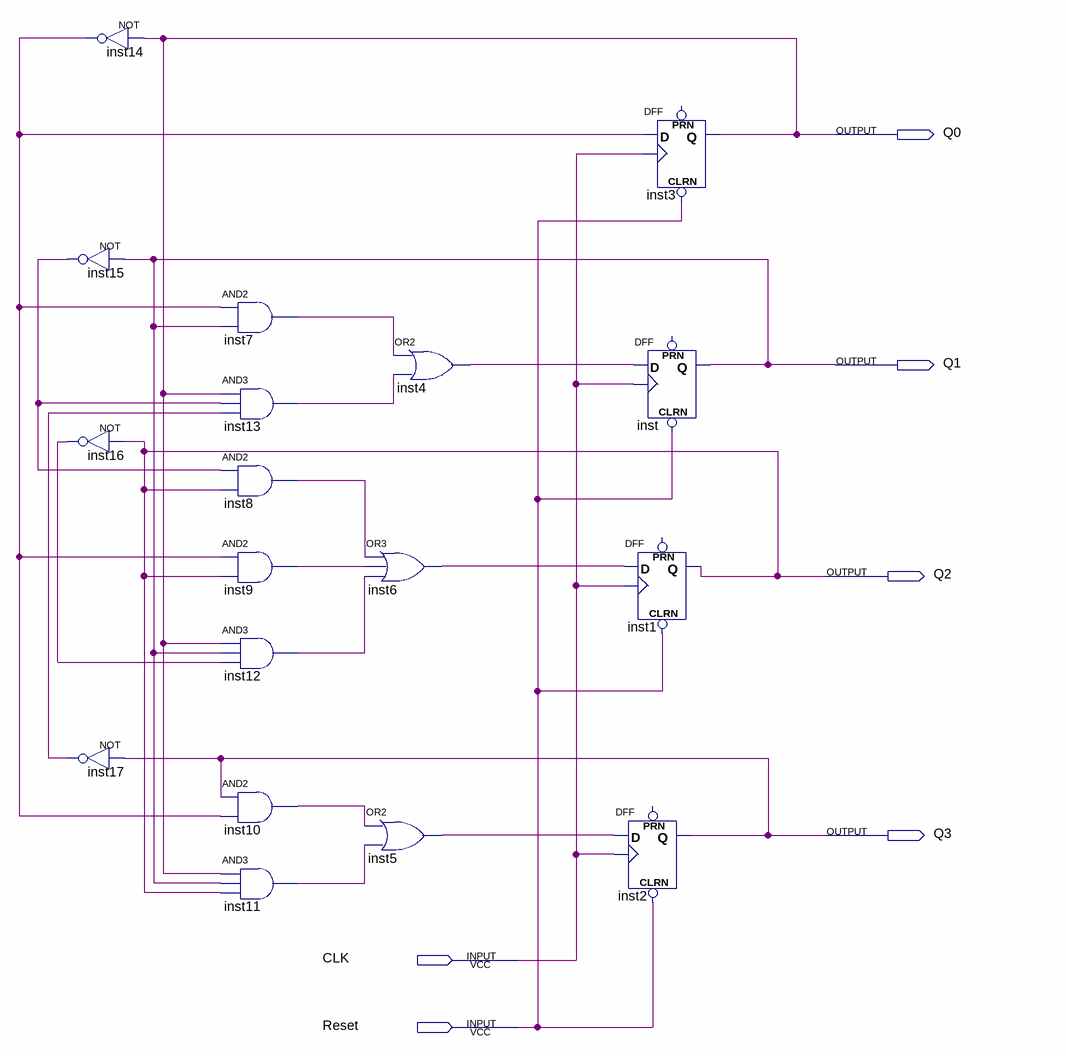
[diagram p0: schematic sheet]
// Quartus schematic BCD_Counter.bdf as structural Verilog: 18 symbols, 6 pins
module BCD_Counter (
  input  CLK,
  input  Reset,
  output Q0,
  output Q1,
  output Q2,
  output Q3
);

  wire inst4_out, inst5_out, inst6_out, inst7_out, inst8_out, inst9_out, inst10_out, inst11_out, inst12_out,
       inst13_out, inst14_out, inst15_out, inst16_out, inst17_out;

  not inst14 (inst14_out, Q0);
  not inst15 (inst15_out, Q1);
  not inst16 (inst16_out, Q2);
  not inst17 (inst17_out, Q3);
  and inst7 (inst7_out, inst14_out, Q1);
  and inst13 (inst13_out, Q0, inst15_out, inst17_out);
  and inst8 (inst8_out, inst15_out, Q2);
  and inst9 (inst9_out, inst14_out, Q2);
  and inst12 (inst12_out, Q0, Q1, inst16_out);
  and inst10 (inst10_out, Q3, inst14_out);
  and inst11 (inst11_out, Q0, Q1, Q2);
  or inst4 (inst4_out, inst7_out, inst13_out);
  or inst6 (inst6_out, inst8_out, inst9_out, inst12_out);
  or inst5 (inst5_out, inst10_out, inst11_out);
  DFF inst3 (.CLRN(Reset), .CLK(CLK), .D(inst14_out), .Q(Q0));  // open: PRN
  DFF inst (.CLRN(Reset), .CLK(CLK), .D(inst4_out), .Q(Q1));  // open: PRN
  DFF inst1 (.CLRN(Reset), .CLK(CLK), .D(inst6_out), .Q(Q2));  // open: PRN
  DFF inst2 (.CLRN(Reset), .CLK(CLK), .D(inst5_out), .Q(Q3));  // open: PRN
endmodule
